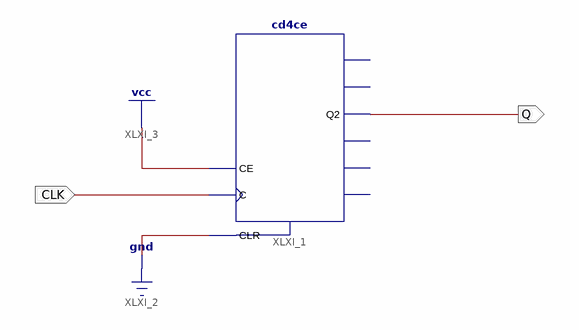
[diagram p0: schematic sheet 1]
// Xilinx ISE schematic div10.sch (spartan3e) as structural Verilog: 1 symbols, 2 ports
module div10 (
  input  CLK,
  output Q
);

  cd4ce XLXI_1 (.C(CLK), .CE(1'b1), .CLR(1'b0), .Q2(Q));  // open: CEO, Q0, Q1, Q3, TC
endmodule
